# Altium schematic sheet POWER.SchDoc
size A4; Author: Khanh BK; Organization: DB Bach Khoa HN; Address1: Bach Khoa- HBT - HN; Address2: khanh.db192932; Address3: Youtube: Đào Bá Khánh; Address4: 0357698570; Revision: 1.0Ver; SheetNumber: 5; SheetTotal: 6
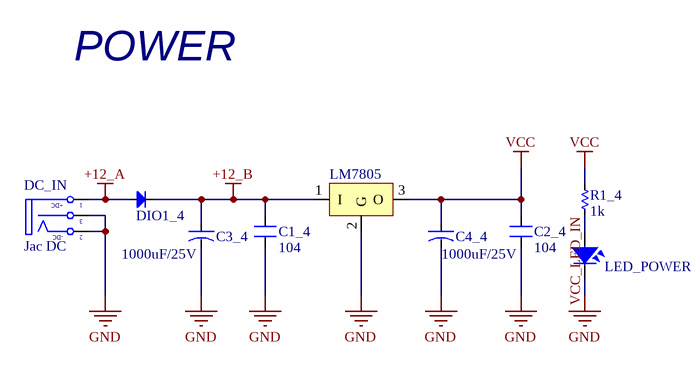
[diagram p0: POWER.SchDoc]

## Parts
C1_4  104  [CN-SMD-0805]
C2_4  104  [CN-SMD-0805]
C3_4  1000uF/25V  [CAP-ALU-SMD-4.5x5x1.4]
C4_4  1000uF/25V  [CAP-ALU-SMD-4.5x5x1.4]
DC_IN  Jac DC  [DC0]
DIO1_4  Diode SMD  [DIO-SMD-106]  (value not drawn)
LED_POWER  LED  [LED-RED-0805]  (value not drawn)
LM7805  LM78xx  [TO252-123]  (value not drawn)
R1_4  1k  [RES-SMD-0805]

## Nets
+12_A: DC_IN.1(T) DIO1_4.1(A)
+12_B: C1_4.2 C3_4.1 DIO1_4.2(K) LM7805.1(I)
GND: C1_4.1 C2_4.1 C3_4.2 C4_4.2 DC_IN.2(TN) DC_IN.3(S) LED_POWER.2 LM7805.2(G)
VCC: C2_4.2 C4_4.1 LM7805.3(O) R1_4.1
VCC_LED_IN: LED_POWER.1 R1_4.2

## Notes on the sheet
- POWER
- Title
- Size:
- Date:
- Author:
- A4
- Time:
- Number:
- Checked:
- Revision:
- Sheet
- Approved:
- of
- File:
- (in symbol DCIN) +DC; -DC

## Library data of the parts
C1_4 C2_4 = CN: Value: 33pF
C3_4 C4_4 = CN-ALU-SMD: Polarized Capacitor (Axial); Published: 8-Jun-2000; LatestRevisionDate: 17-Jul-2002; LatestRevisionNote: Re-released for DXP Platform.; PackageReference: POLAR0.8; Publisher: Altium Limited
DC_IN = DCIN: Jac DC input; Value: Jac DC
DIO1_4 = Diode SMD: Default Diode; Code - JEDEC: DO-214-AB; Value: 1N5007; Published: 8-Jun-2000; Revision: July-2002: Re-released for DXP Platform.; Publisher: Altium Limited
LED_POWER = LED SMD: Value: LED 3 - 5 ly 2 Colour
LM7805 = LM78xx: Positive Voltage Regulator; Note: Tab is connected to pin 3 (GND).; Published: 24-Aug-2001; LatestRevisionDate: 17-Jul-2002; LatestRevisionNote: Re-released for DXP Platform.; DatasheetVersion: Apr-1994; PackageVersion: Jul-1998; PackageReference: ISOWATT220AB; Publisher: Altium Limited; PackageDescription: TO, Thru-Hole, Vertical, Heatsink Mounted; 3 In-Line Leads; Pitch 2.54 mm; Pin sequence 1, 3, 2; ComponentLink1Description: Manufacturer Link; ComponentLink1URL: http://www.st.com/; ComponentLink2Description: Datasheet; ComponentLink2URL: http://www.st.com/stonline/products/literature/ds/2146/l78m05c.pdf
R1_4 = Res-SMD: Resistor; Manufacturer: Generic Components; Class: Passive; Published: 08/06/2000; Publisher: Altium Hobart Technology Centre